# EAGLE schematic NTCSHTshield (EAGLE 6.6.0)
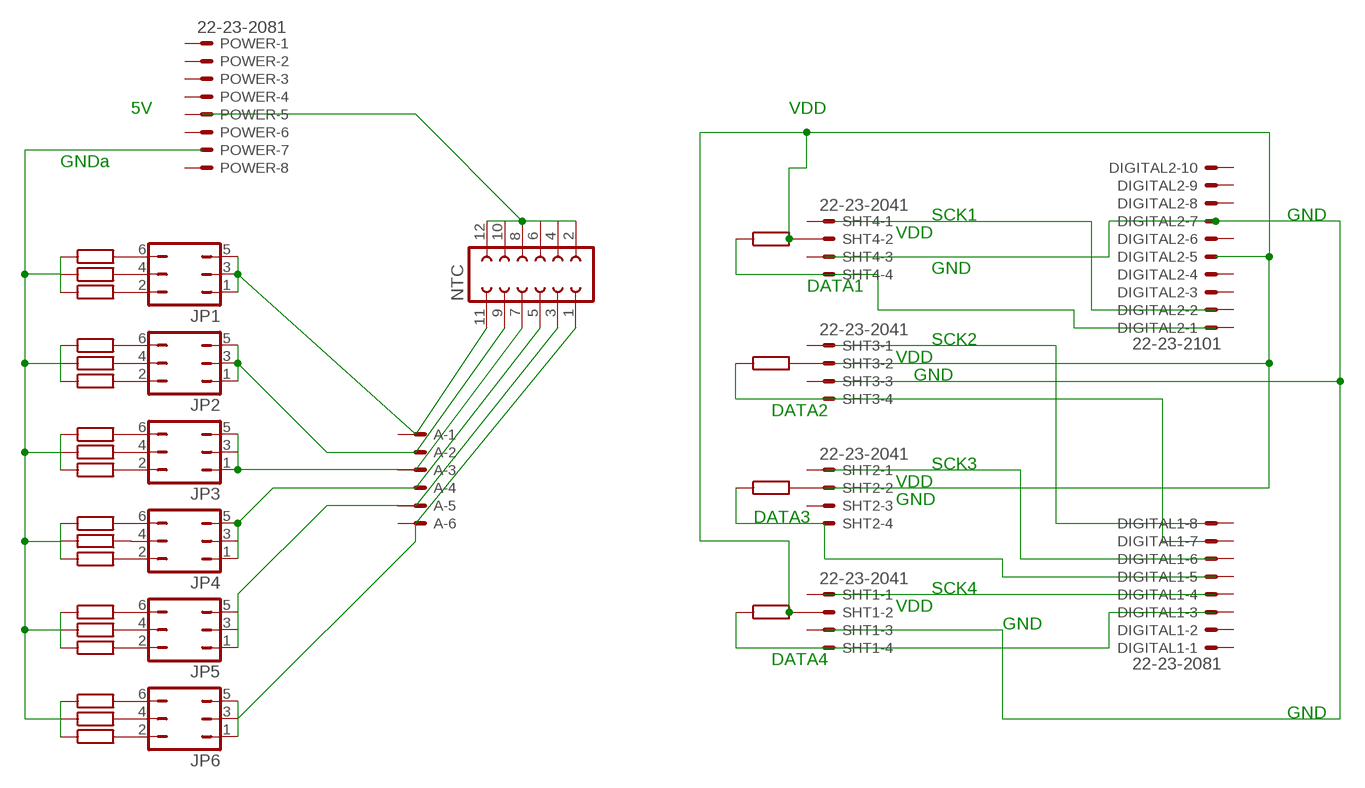
[diagram p0: schematic, sheet 1]

## Parts
A  22-23-2061  [22-23-2061]
DIGITAL1  22-23-2081  [22-23-2081]
DIGITAL2  22-23-2101  [22-23-2101]
JP1  JP3Q  [JP3Q]
JP2  JP3Q  [JP3Q]
JP3  JP3Q  [JP3Q]
JP4  JP3Q  [JP3Q]
JP5  JP3Q  [JP3Q]
JP6  JP3Q  [JP3Q]
NTC  FE06-2  [FE06-2]
POWER  22-23-2081  [22-23-2081]
SHT1  22-23-2041  [22-23-2041]
SHT2  22-23-2041  [22-23-2041]
SHT3  22-23-2041  [22-23-2041]
SHT4  22-23-2041  [22-23-2041]

## Nets
N$8: JP2.1 JP2.3 JP2.5 NTC.9
N$10: JP4.1 JP4.3 JP4.5 NTC.5
N$12: JP6.1 JP6.3 JP6.5 NTC.1
N$14: NTC.2 NTC.4 NTC.6 NTC.8 NTC.10 NTC.12
N$15: JP1.1 JP1.3 JP1.5 NTC.11
N$17: JP3.1 JP3.3 JP3.5 NTC.7
N$19: JP5.1 JP5.3 JP5.5 NTC.3
Unconnected: A.1 A.2 A.3 A.4 A.5 A.6 DIGITAL1.1 DIGITAL1.2 DIGITAL1.3 DIGITAL1.4 DIGITAL1.5 DIGITAL1.6 DIGITAL1.7 DIGITAL1.8 DIGITAL2.1 DIGITAL2.2 DIGITAL2.3 DIGITAL2.4 DIGITAL2.5 DIGITAL2.6 DIGITAL2.7 DIGITAL2.8 DIGITAL2.9 DIGITAL2.10 JP1.2 JP1.4 JP1.6 JP2.2 JP2.4 JP2.6 JP3.2 JP3.4 JP3.6 JP4.2 JP4.4 JP4.6 JP5.2 JP5.4 JP5.6 JP6.2 JP6.4 JP6.6 POWER.1 POWER.2 POWER.3 POWER.4 POWER.5 POWER.6 POWER.7 POWER.8 SHT1.1 SHT1.2 SHT1.3 SHT1.4 SHT2.1 SHT2.2 SHT2.3 SHT2.4 SHT3.1 SHT3.2 SHT3.3 SHT3.4 SHT4.1 SHT4.2 SHT4.3 SHT4.4

## Notes on the sheet
- 5V | VDD
- GNDa
- SCK1 | GND
- VDD
- GND
- DATA1
- SCK2
- VDD
- GND
- DATA2
- SCK3
- VDD
- GND
- DATA3
- SCK4
- VDD
- GND
- DATA4
- GND

## Library data of the parts
A = con-molex:22-23-2061: .100" (2.54mm) Center Header - 6 Pin; MF: MOLEX; MPN: 22-23-2061; OC_FARNELL: 1462922; OC_NEWARK: 27C1933
DIGITAL1 POWER = con-molex:22-23-2081: .100" (2.54mm) Center Header - 8 Pin; MF: MOLEX; MPN: 22-23-2081; OC_FARNELL: 1756826; OC_NEWARK: 01C7592
DIGITAL2 = con-molex:22-23-2101: .100" (2.54mm) Center Header - 10 Pin; MF: MOLEX; MPN: 22-23-2101; OC_FARNELL: 1756828; OC_NEWARK: 94C0765
JP1-JP6 = jumper:JP3Q: JUMPER
NTC = con-lsta:FE06-2: FEMALE HEADER; OC_FARNELL: unknown; OC_NEWARK: unknown
SHT1-SHT4 = con-molex:22-23-2041: .100" (2.54mm) Center Header - 4 Pin; MF: MOLEX; MPN: 22-23-2041; OC_FARNELL: 1462920; OC_NEWARK: 38C0355